# EAGLE design probe (EAGLE 9.6.1)
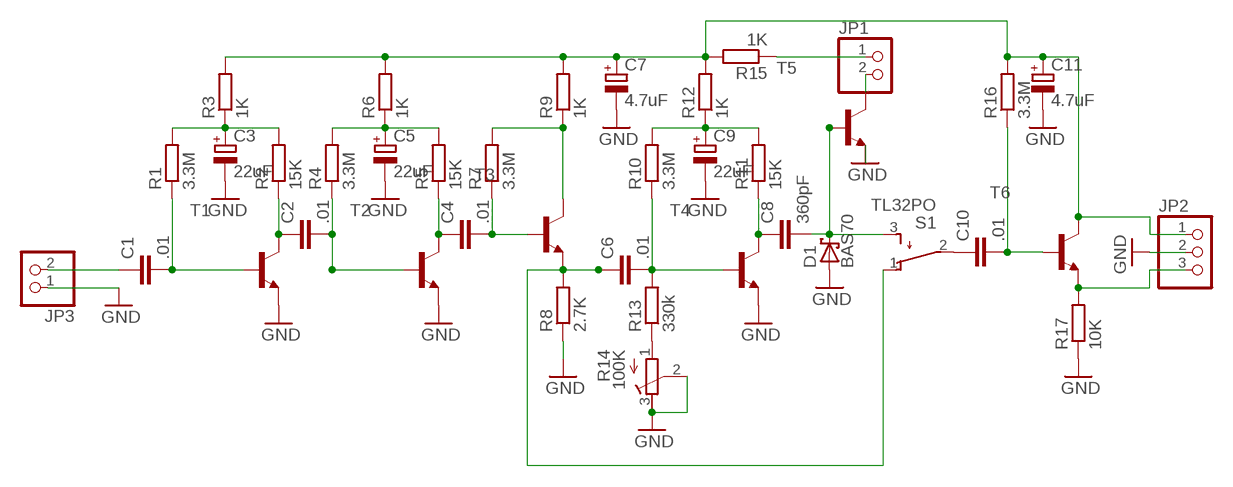
[diagram p0: schematic, sheet 1]

## Parts
C1  .01  C-EUC0603  [C0603]
C2  .01  C-EUC0603  [C0603]
C3  22uF  CPOL-EUCT3528  [CT3528]
C4  .01  C-EUC0603  [C0603]
C5  22uF  CPOL-EUCT3528  [CT3528]
C6  .01  C-EUC0603  [C0603]
C7  4.7uF  CPOL-EUCT3528  [CT3528]
C8  360pF  C-EUC0603  [C0603]
C9  22uF  CPOL-EUCT3528  [CT3528]
C10  .01  C-EUC0603  [C0603]
C11  4.7uF  CPOL-EUCT3528  [CT3528]
D1  BAS70  [SOT23]
JP1  PINHD-1X2  [1X02]
JP2  PINHD-1X3  [1X03]
JP3  PINHD-1X2  [1X02]
R1  3.3M  R-EU_R0603  [R0603]
R2  15K  R-EU_R0603  [R0603]
R3  1K  R-EU_R0603  [R0603]
R4  3.3M  R-EU_R0603  [R0603]
R5  15K  R-EU_R0603  [R0603]
R6  1K  R-EU_R0603  [R0603]
R7  3.3M  R-EU_R0603  [R0603]
R8  2.7K  R-EU_R0603  [R0603]
R9  1K  R-EU_R0603  [R0603]
R10  3.3M  R-EU_R0603  [R0603]
R11  15K  R-EU_R0603  [R0603]
R12  1K  R-EU_R0603  [R0603]
R13  330k  R-EU_R0603  [R0603]
R14  100K  R-TRIMM3103  [RTRIM3103]
R15  1K  R-EU_R0603  [R0603]
R16  3.3M  R-EU_R0603  [R0603]
R17  10K  R-EU_R0603  [R0603]
S1  TL32PO  [TL3XPO]
T1  BC848-NPN-SOT23-BEC  [SOT23-BEC]
T2  BC848-NPN-SOT23-BEC  [SOT23-BEC]
T3  BC848-NPN-SOT23-BEC  [SOT23-BEC]
T4  BC848-NPN-SOT23-BEC  [SOT23-BEC]
T5  BC848-NPN-SOT23-BEC  [SOT23-BEC]
T6  BC848-NPN-SOT23-BEC  [SOT23-BEC]

## Nets
GND: C3.- C5.- C7.- C9.- C11.- D1.1(A) JP2.2 JP3.1 R8.1 R14.2(S) R14.3(E) R17.1 T1.E T2.E T4.E T5.E
N$1: C1.2 R1.1 T1.B
N$2: C2.1 R2.1 T1.C
N$3: C3.+ R1.2 R2.2 R3.1
N$4: C2.2 R4.1 T2.B
N$5: C4.1 R5.1 T2.C
N$6: C5.+ R4.2 R5.2 R6.1
N$7: C4.2 R7.1 T3.B
N$8: R7.2 R9.1 T3.C
N$9: C6.1 R8.2 S1.1(O) T3.E
N$10: C6.2 R10.1 R13.2 T4.B
N$11: C8.1 R11.1 T4.C
N$12: C9.+ R10.2 R11.2 R12.1
N$13: R13.1 R14.1(A)
N$14: JP1.1 R15.1
N$15: C1.1 JP3.2
N$16: C8.2 D1.3(C) S1.3(S) T5.B
N$17: C7.+ C11.+ JP2.1 R3.2 R6.2 R9.2 R12.2 R15.2 R16.2 T6.C
N$18: C10.2 R16.1 T6.B
N$19: C10.1 S1.2(P)
N$20: JP2.3 R17.2 T6.E
N$21: JP1.2 T5.C

## Library data of the parts
C1 C2 C4 C6 C8 C10 = rcl:C-EU: CAPACITOR, European symbol
C3 C5 C7 C9 C11 = rcl:CPOL-EU: POLARIZED CAPACITOR, European symbol
D1 = diode:BAS70: Silicon Schottky Diodes General-purpose diode for high-speed switching
JP1 JP3 = pinhead:PINHD-1X2: PIN HEADER
JP2 = adafruit:PINHD-1X3: PIN HEADER
R1-R13 R15-R17 = resistor:R-EU_: RESISTOR, European symbol
R14 = rcl:R-TRIMM: Trimm resistor; SPICEMODEL: X; SPICEPREFIXL: POT
S1 = switch:TL32PO: TINY SWITCH ON - MOM Source: http://www2.produktinfo.conrad.com/datenblaetter/700000-724999/705152-da-01-de-Subminiaturschalter_TL_36YO.pdf
T1-T6 = transistor:*-NPN-: NPN Transistror BF959 corrected 2008.03.06

## Board
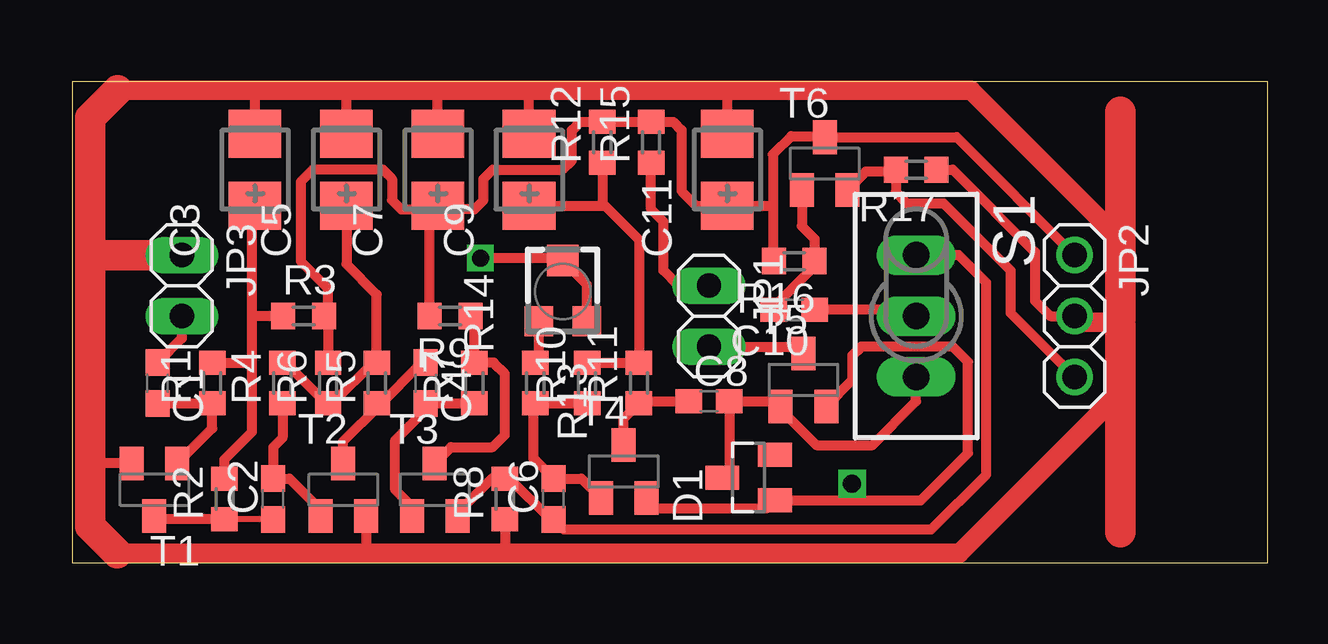
[diagram p1: board, top side]
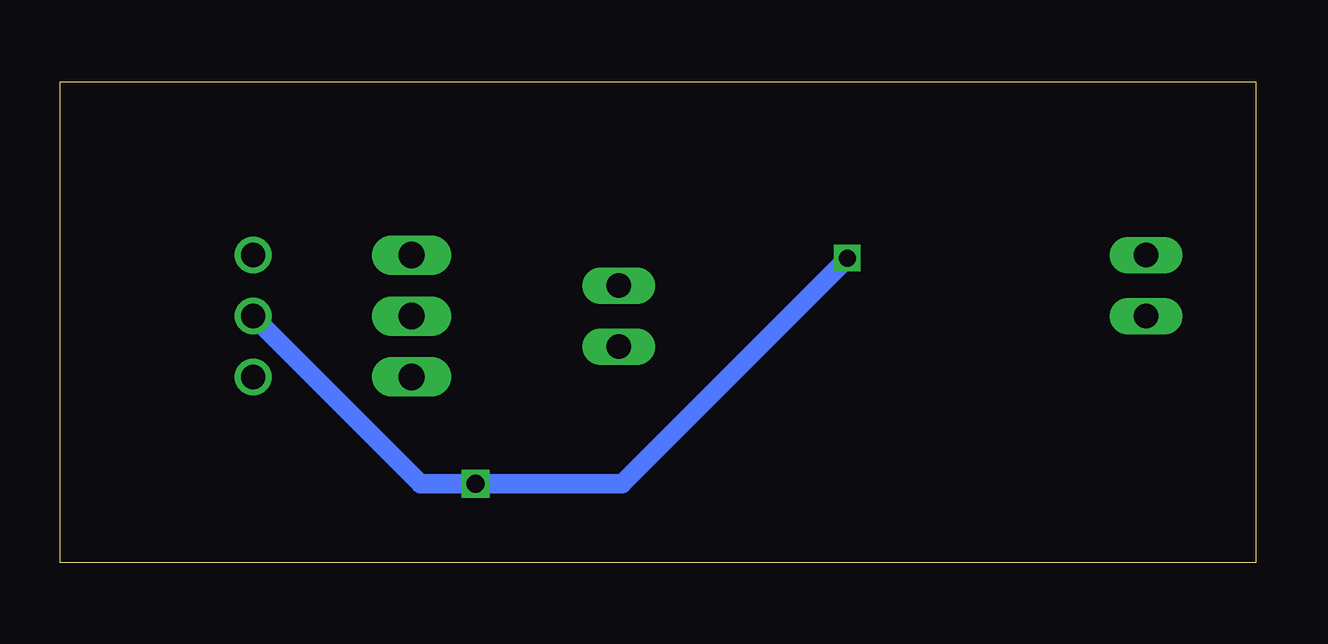
[diagram p2: board, bottom side, seen from below]

Size 49.84 x 20.06 mm. Coordinates in mm from the lower left corner, seen from the top.
Outline: 0,0 49.84,0 49.84,20.06 0,20.06 0,0
Copper layers (1*16): Top 0.035mm / dielectric 1.5mm / Bottom 0.035mm
Design rules "default *": minimum track width 6mil, minimum drill 0.35mm, track to track 6mil, track to pad 6mil, pad to pad 6mil, via to via 6mil, smd to smd 6mil, copper to edge 0mil, drill to drill 6mil, minimum pad ring 10mil, minimum via ring 8mil, stop-mask expansion 4mil, vias tented up to drill 0mil, thermal gap 10mil

### Footprints (pad centres in the part's own frame; a part is rotated, then mirrored left to right if it is on the bottom)
C0603 = smd 1.1 x 1: 1 -0.85,0; 2 0.85,0
CT3528 = smd 2 x 2.2: + -1.5,0; - 1.5,0
SOT23 = smd 1 x 1.4: 1 -0.95,-1.1; 2 0.95,-1.1; 3 0,1.1
1X02 = drill 1.016 long: 1 -1.27,0; 2 1.27,0
1X03 = drill 1.016: 1 -2.54,0; 2 0,0; 3 2.54,0
R0603 = smd 1 x 1.1: 1 -0.85,0; 2 0.85,0
RTRIM3103 = smd 1.2 x 1.25: 1 -1,-1.225; 3 1,-1.225 | smd 1.3 x 1.3: 2 0,1.3
TL3XPO = drill 1.1 pad 1.422 long: 1 -2.54,0; 2 0,0; 3 2.54,0
SOT23-BEC = smd 1 x 1.4: B -0.95,-1.1; C 0,1.1; E 0.95,-1.1

### Placement (x,y rotation side)
C1  3.56,7.49 270 top
C2  8.38,2.67 90 top
C3  7.62,16.38 90 top
C4  14.73,7.49 270 top
C5  11.43,16.38 90 top
C6  20.07,2.67 90 top
C7  15.24,16.38 90 top
C8  26.54,6.73 0 top
C9  19.05,16.38 90 top
C10  30.1,10.54 180 top
C11  27.3,16.38 90 top
D1  28.19,3.56 90 top
JP1  26.54,10.29 270 top
JP2  41.78,10.29 270 top
JP3  4.57,11.56 270 top
R1  5.84,7.49 90 top
R2  6.35,2.67 90 top
R3  9.65,10.29 0 top
R4  8.76,7.49 90 top
R5  12.7,7.49 90 top
R6  10.67,7.49 90 top
R7  16.76,7.49 90 top
R8  18.03,2.67 90 top
R9  15.75,10.29 180 top
R10  21.46,7.49 90 top
R11  23.62,7.49 90 top
R12  22.1,17.53 90 top
R13  19.3,7.49 270 top
R14  20.45,11.3 0 top
R15  24.13,17.53 90 top
R16  30.1,12.57 180 top
R17  35.18,16.38 180 top
S1  35.18,10.29 270 top
T1  3.43,3.05 180 top
T2  11.3,3.05 0 top
T3  15.11,3.05 0 top
T4  22.99,3.81 0 top
T5  30.48,7.62 0 top
T6  31.37,16.64 0 top

### Tracks (layer width: path | path; a pad name or v marks a point on that pad's centre or on a via)
GND  (via drill 0.7, 0.75)
  Top 0.406: 9.82,0.58 9.65,0.41 | T2.E 12.25,0.47 12.19,0.41 | C3.- 7.62,19.68 | C5.- 11.43,19.68 | R8.1 18.03,0.41 | R14.3 21.45,11.6 R14.2 20.35,12.7 v17.02,12.7 | R17.1 36.7,16.38 40.13,12.95 40.13,10.92 40.77,10.29 JP2.2 | T4.E 24.36,2.29 28.97,2.29 D1.1 32.51,2.61 | 32.51,2.61 35.37,2.61 37.34,4.57 37.34,8.38 36.7,9.02 32.89,9.02 32.51,8.64 32.51,7.6 T5.E | 32.51,2.61 v32.51,3.3 | T1.E 0.85,4.15 0.76,4.06 | C7.- 15.24,19.68 | C9.- 19.05,19.68 | C11.- 27.3,19.56 27.18,19.68
  Top 0.508: 12.87,0.45 12.83,0.41
  Top 0.813: JP2.2 42.04,10.03 43.56,10.03 | 1.91,19.68 7.62,19.68 11.43,19.68 15.24,19.68 19.05,19.68 27.18,19.68 37.47,19.68 43.56,13.59 43.56,10.03 | 1.88,0.41 9.65,0.41 12.19,0.41 12.83,0.41 18.03,0.41 36.98,0.41 43.56,6.99 43.56,10.03
  Top 1.27: 1.88,0.41 0.76,1.52 0.76,4.06 0.76,12.95 | 1.91,19.68 0.76,18.54 0.76,12.95 | JP3.1 0.89,12.83 0.76,12.95 | 43.69,1.27 43.69,9.91 43.56,10.03 43.69,10.16 43.69,18.8
  Bottom 0.813: v17.02,12.7 26.42,3.3 v32.51,3.3 34.8,3.3 JP2.2
N$1
  Top 0.406: C1.2 R1.1 5.84,5.61 T1.B
N$2
  Top 0.254: C2.1 R2.1
  Top 0.406: R2.1 3.56,1.82 T1.C
N$3
  Top 0.406: R3.1 7.49,10.29 | 7.49,10.29 7.49,14.76 C3.+ | R2.2 6.35,4.32 7.49,5.46 7.49,8.38 | 7.49,8.38 7.49,10.29 | R1.2 7.45,8.34 7.49,8.38
N$4
  Top 0.406: T2.B 10.35,2.22 9.06,3.52 C2.2 8.38,4.83 8.76,5.21 R4.1
N$5
  Top 0.406: 12.78,6.56 R5.1 | T2.C 11.3,5.08 12.78,6.56 | 12.78,6.56 14.57,8.34 C4.1
N$6
  Top 0.406: C5.+ 11.43,12.45 12.7,11.18 R5.2 12.62,8.43 10.83,6.64 R6.1 10.59,6.64 8.89,8.34 R4.2
N$7
  Top 0.406: T3.B 14.16,2.35 13.46,3.05 13.46,5.12 14.73,6.39 C4.2 R7.1
N$8
  Top 0.406: R9.1 16.76,10.12 R7.2 17.57,8.34 18.03,7.87 18.03,5.33 17.53,4.83 15.79,4.83 T3.C
N$9
  Top 0.406: T3.E 16.06,2.09 17.49,3.52 R8.2 18.24,3.52 19.94,1.82 C6.1 20.49,1.4 35.81,1.4 38.1,3.68 38.1,11.68 36.96,12.83 S1.1
N$10
  Top 0.254: 19.23,6.57 R13.2
  Top 0.406: 19.23,6.57 19.23,4.36 C6.2 21.23,3.52 T4.B | R13.2 R10.1
N$11
  Top 0.406: T4.C 22.99,6.01 R11.1 23.71,6.73 C8.1
N$12
  Top 0.406: R10.2 R11.2 23.62,13.46 22.2,14.88 22.1,14.88 | C9.+ 22.1,14.88 | R12.1 22.1,14.88
N$13
  Top 0.406: R14.1 19.45,8.49 R13.1
N$14
  Top 0.406: R15.1 24.13,14.73 24.64,14.22 24.64,12.19 25.27,11.56 JP1.1
N$15
  Top 0.406: JP3.2 4.57,9.36 C1.1
N$16
  Top 0.406: S1.3 35.18,6.73 33.36,4.91 31.01,4.91 29.53,6.39 T5.B 29.32,6.73 C8.2 27.39,3.85 D1.3
N$17
  Top 0.406: R6.2 10.67,10.12 R3.2 10.46,10.33 10.67,10.54 10.67,11.43 9.53,12.57 9.53,15.88 10.03,16.38 12.95,16.38 13.34,16 13.34,15.11 13.72,14.73 15.09,14.73 | 15.09,14.73 C7.+ | 15.09,14.73 16.76,14.73 17.14,15.11 17.14,16 17.53,16.38 20.45,16.38 20.83,16.76 20.83,18.03 21.17,18.38 R12.2 R15.2 25.06,18.38 25.4,18.03 25.4,15.49 26.01,14.88 C11.+ 29.11,14.88 29.21,14.99 | R9.2 14.9,14.54 15.09,14.73 | JP2.1 36.87,17.74 T6.C 31.33,17.78 29.97,17.78 29.21,17.02 29.21,14.99 | 29.21,14.99 29.21,12.61 R16.2
N$18
  Top 0.406: T6.B 30.42,14.03 30.95,13.5 R16.1 30.95,12.37 29.25,10.67 C10.2
N$19
  Top 0.406: S1.2 34.92,10.54 C10.1
N$20
  Top 0.406: T6.E 33.08,16.3 34.24,16.3 R17.2 34.33,15.46 34.8,14.99 36.32,14.99 39.12,12.19 39.12,10.41 JP2.3
N$21
  Top 0.406: JP1.2 30.18,9.02 T5.C